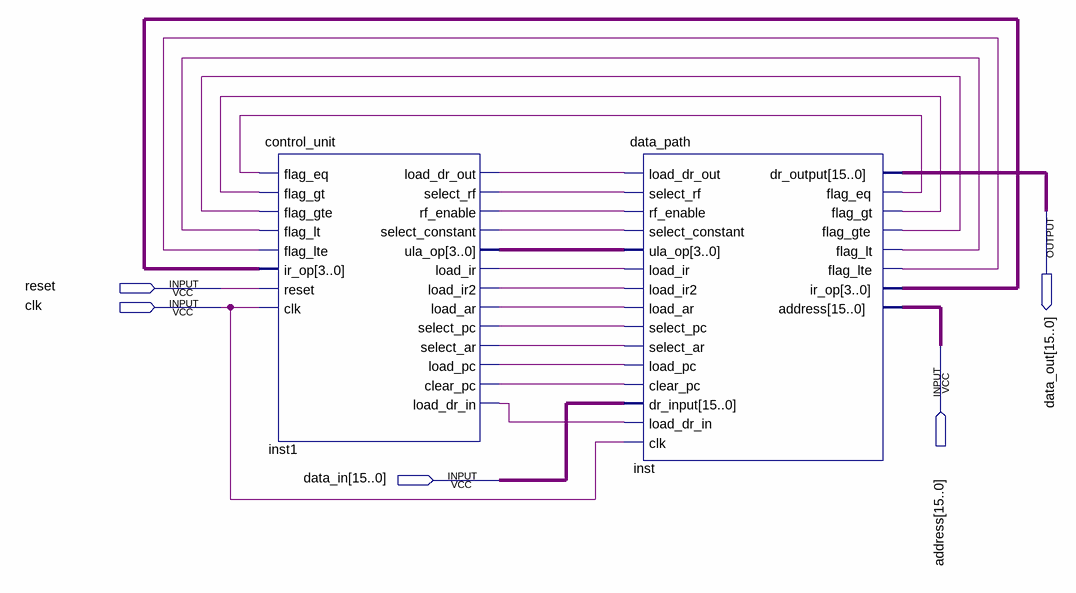
[diagram p0: schematic sheet]
// Quartus schematic Microprocessor.bdf as structural Verilog: 2 symbols, 5 pins
module Microprocessor (
  input  reset,
  input  clk,
  input  [15:0] address,
  input  [15:0] data_in,
  output [15:0] data_out
);

  wire inst1_clear_pc, inst1_load_ar, inst1_load_dr_in, inst1_load_dr_out, inst1_load_ir, inst1_load_ir2,
       inst1_load_pc, inst1_rf_enable, inst1_select_ar, inst1_select_constant, inst1_select_pc,
       inst1_select_rf, inst_flag_eq, inst_flag_gt, inst_flag_gte, inst_flag_lt, inst_flag_lte;
  wire [3:0] inst1_ula_op, inst_ir_op;

  control_unit inst1 (
    .flag_eq(inst_flag_eq), .flag_gt(inst_flag_gt), .flag_gte(inst_flag_gte), .flag_lt(inst_flag_lt),
    .flag_lte(inst_flag_lte), .ir_op(inst_ir_op), .reset(reset), .clk(clk), .load_dr_out(inst1_load_dr_out),
    .select_rf(inst1_select_rf), .rf_enable(inst1_rf_enable), .select_constant(inst1_select_constant),
    .ula_op(inst1_ula_op), .load_ir(inst1_load_ir), .load_ir2(inst1_load_ir2), .load_ar(inst1_load_ar),
    .select_pc(inst1_select_pc), .select_ar(inst1_select_ar), .load_pc(inst1_load_pc),
    .clear_pc(inst1_clear_pc), .load_dr_in(inst1_load_dr_in));
  data_path inst (
    .load_dr_out(inst1_load_dr_out), .select_rf(inst1_select_rf), .rf_enable(inst1_rf_enable),
    .select_constant(inst1_select_constant), .ula_op(inst1_ula_op), .load_ir(inst1_load_ir),
    .load_ir2(inst1_load_ir2), .load_ar(inst1_load_ar), .select_pc(inst1_select_pc),
    .select_ar(inst1_select_ar), .load_pc(inst1_load_pc), .clear_pc(inst1_clear_pc), .dr_input(data_in),
    .load_dr_in(inst1_load_dr_in), .clk(clk), .dr_output(data_out), .flag_eq(inst_flag_eq),
    .flag_gt(inst_flag_gt), .flag_gte(inst_flag_gte), .flag_lt(inst_flag_lt), .flag_lte(inst_flag_lte),
    .ir_op(inst_ir_op), .address(address));
endmodule
